# EAGLE schematic Arduino and MCP3008 basic (EAGLE 6.5.0)
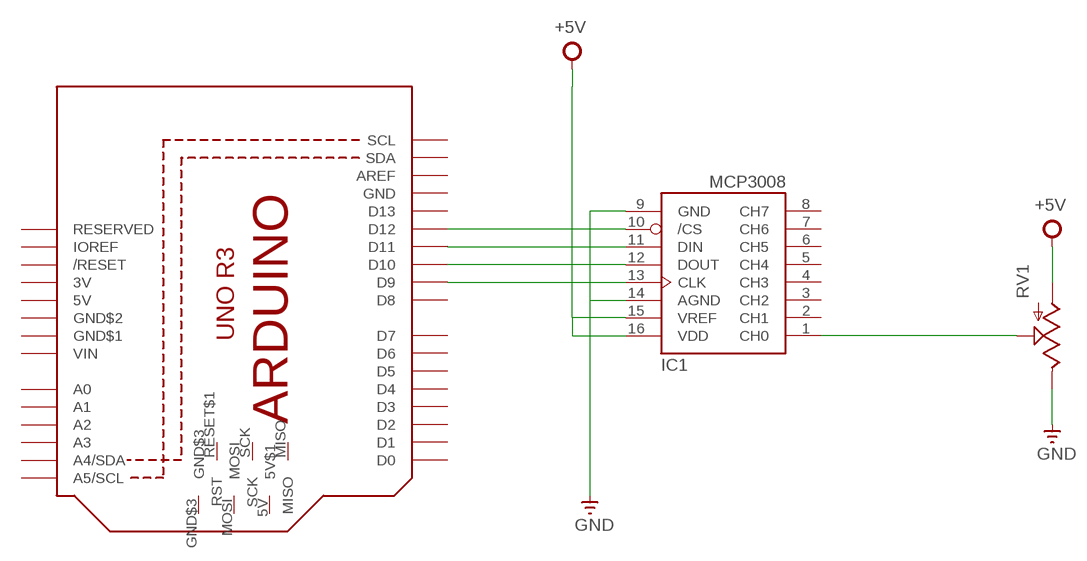
[diagram p0: schematic, sheet 1]

## Parts
IC1  MCP3008  [DIL16]
RV1  POTTRIM  [TRIM_POT]
U$1  ARDUINO_R3_ICSP  [ARDUINOR3_ICSP]

## Nets
+5V: IC1.15(VREF) IC1.16(VDD) RV1.3(A)
GND: IC1.9(GND) IC1.14(AGND) RV1.2(E)
N$1: IC1.13(CLK) U$1.D9
N$2: IC1.12(DOUT) U$1.D10
N$3: IC1.11(DIN) U$1.D11
N$4: IC1.10(/CS) U$1.D12
N$7: IC1.1(CH0) RV1.1(S)
Unconnected: IC1.2(CH1) IC1.3(CH2) IC1.4(CH3) IC1.5(CH4) IC1.6(CH5) IC1.7(CH6) IC1.8(CH7) U$1.5V(5V$1) U$1.A0 U$1.A1 U$1.A2 U$1.A3 U$1.A4(A4/SDA) U$1.A5(A5/SCL) U$1.AREF U$1.D0 U$1.D1 U$1.D2 U$1.D3 U$1.D4 U$1.D5 U$1.D6 U$1.D7 U$1.D8 U$1.D13 U$1.GND$3 U$1.IOREF U$1.MISO U$1.MOSI U$1.RESERVED U$1.RESET$1(RST) U$1.RESET(/RESET) U$1.SCK U$1.SCL U$1.SDA

## Power pins joined to a net without a drawn wire
3V: U$1.3V
5V: U$1.+5V(5V)
GND: U$1.GND
GND$1: U$1.GND$1
GND$2: U$1.GND$2
VIN: U$1.VIN

## Library data of the parts
IC1 = adafruit:MCP3008
RV1 = SparkFun-Electromechanical:POT
U$1 = adafruit:ARDUINO_R3_ICSP